# EasyEDA Pro project 3轴6.1--esp32 -(0604)改.eprj, board PCB
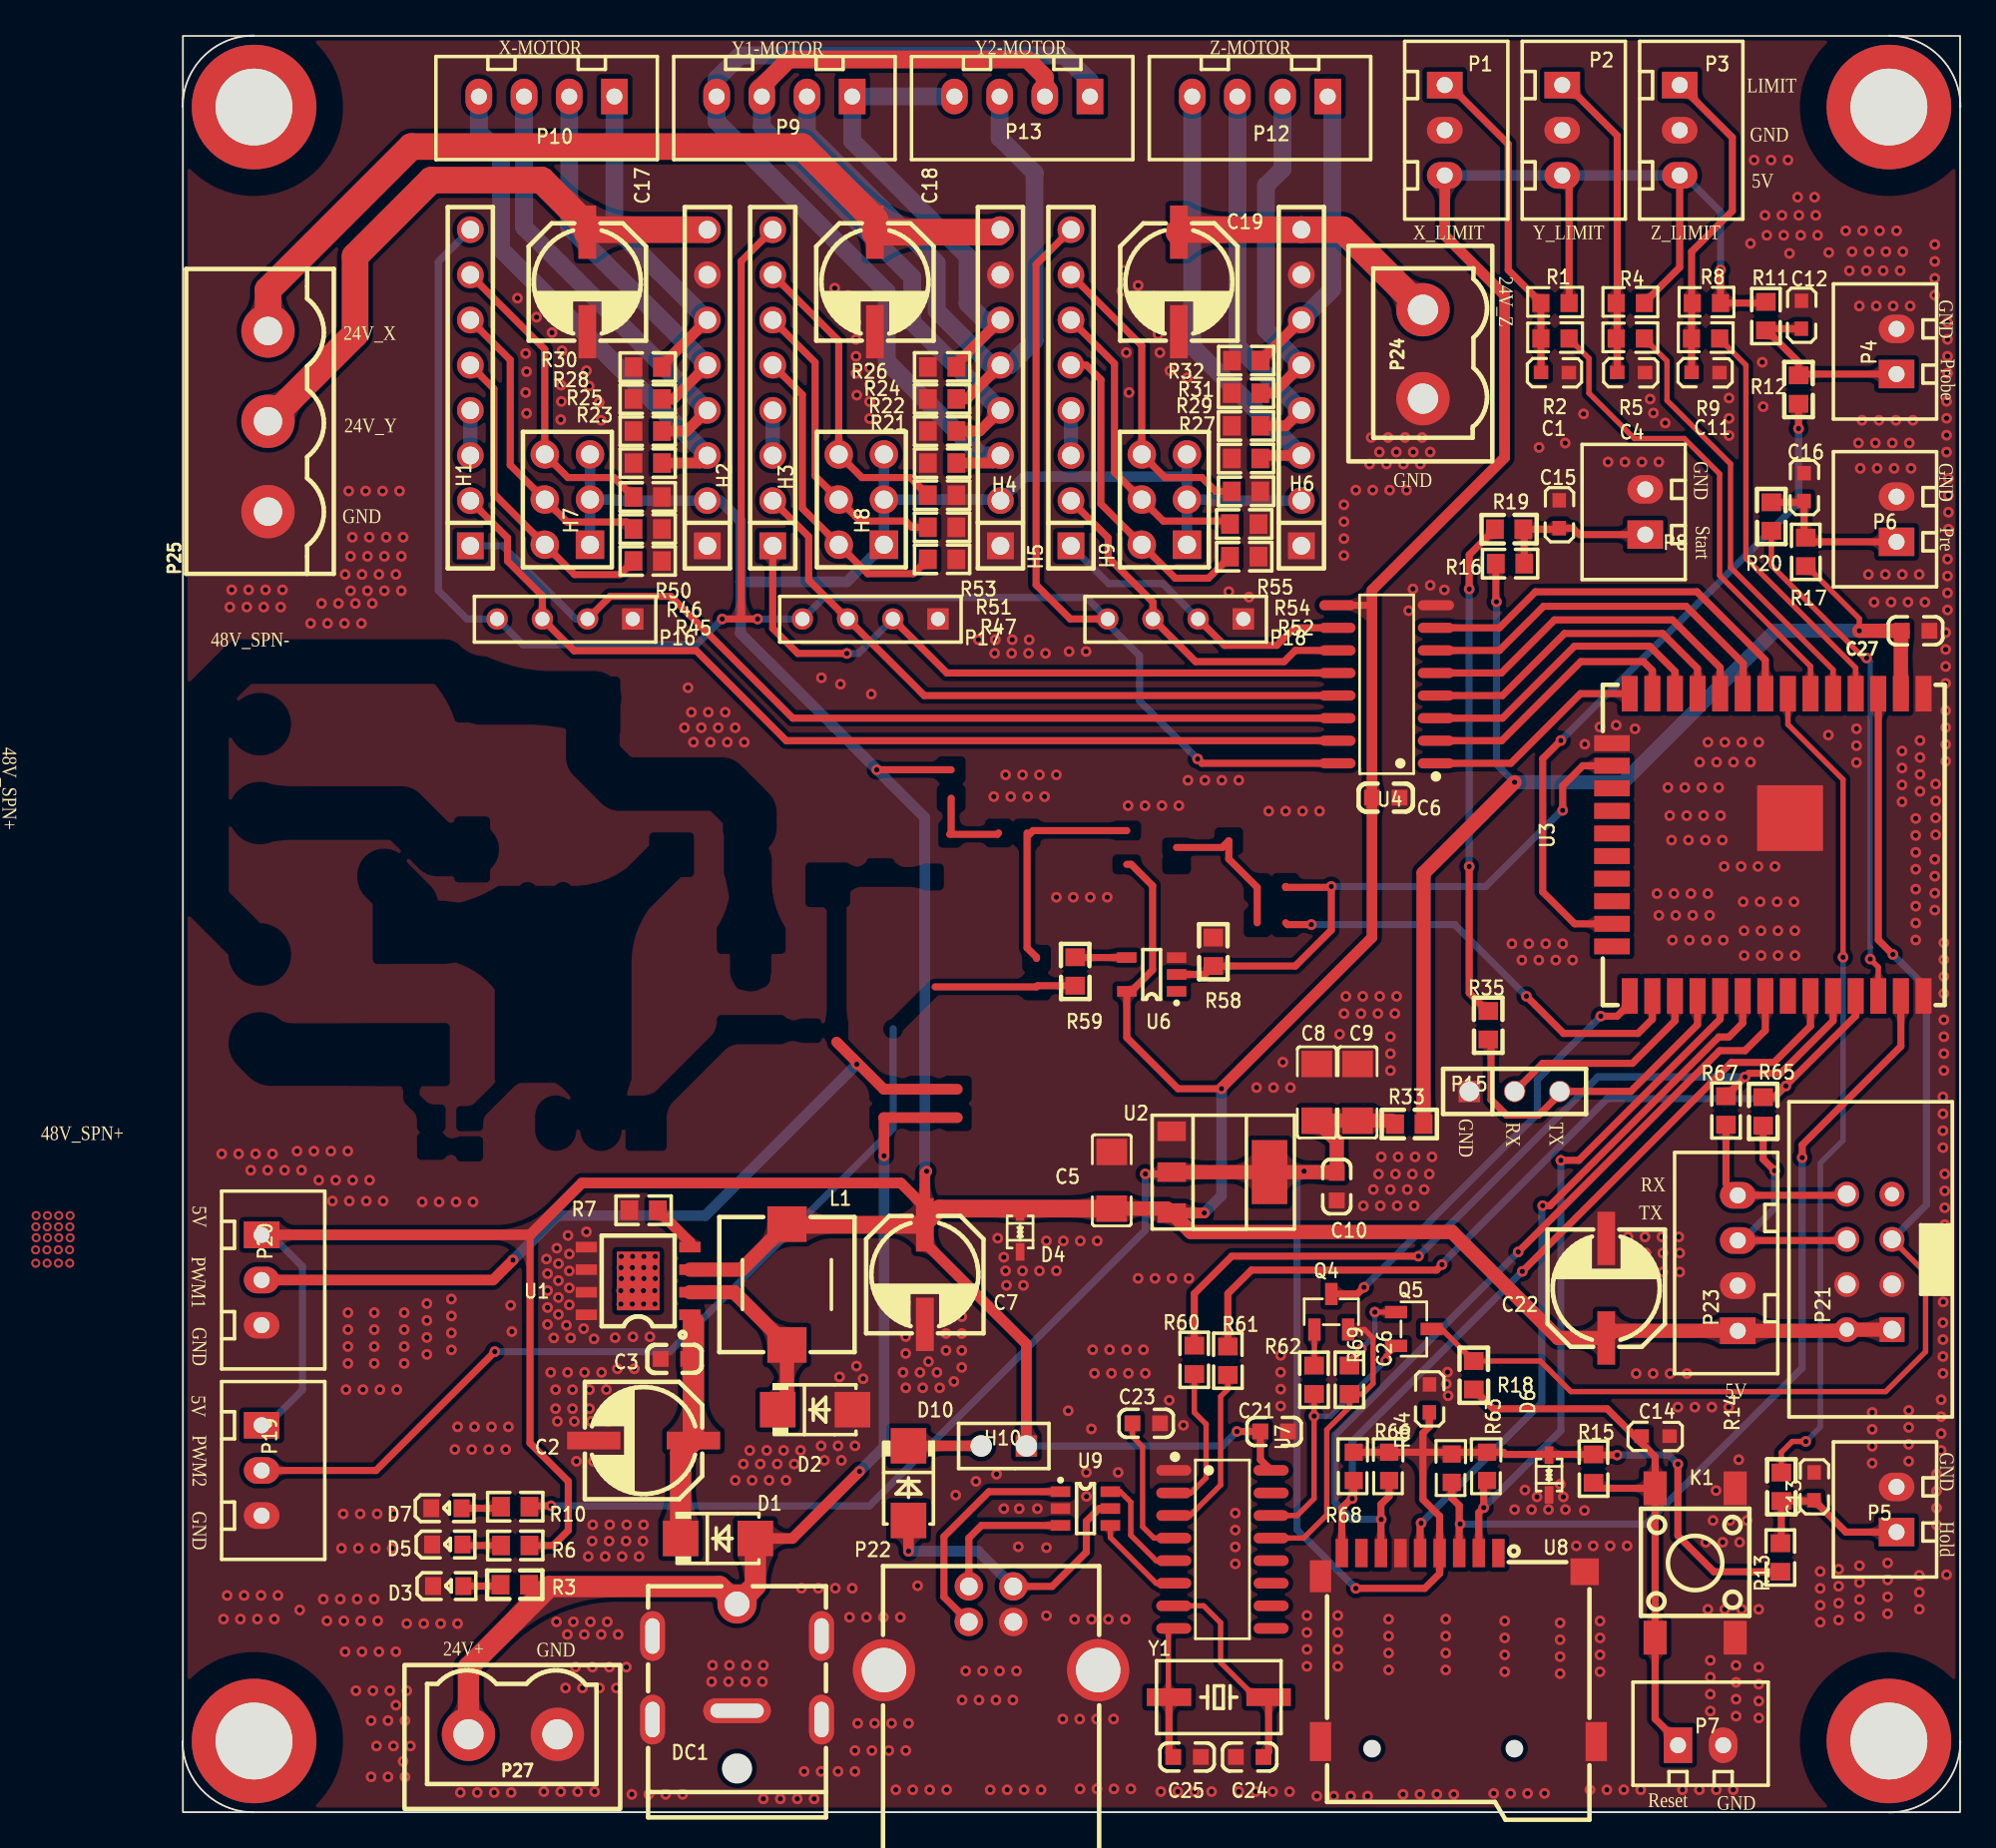
[diagram p1: board, top side]
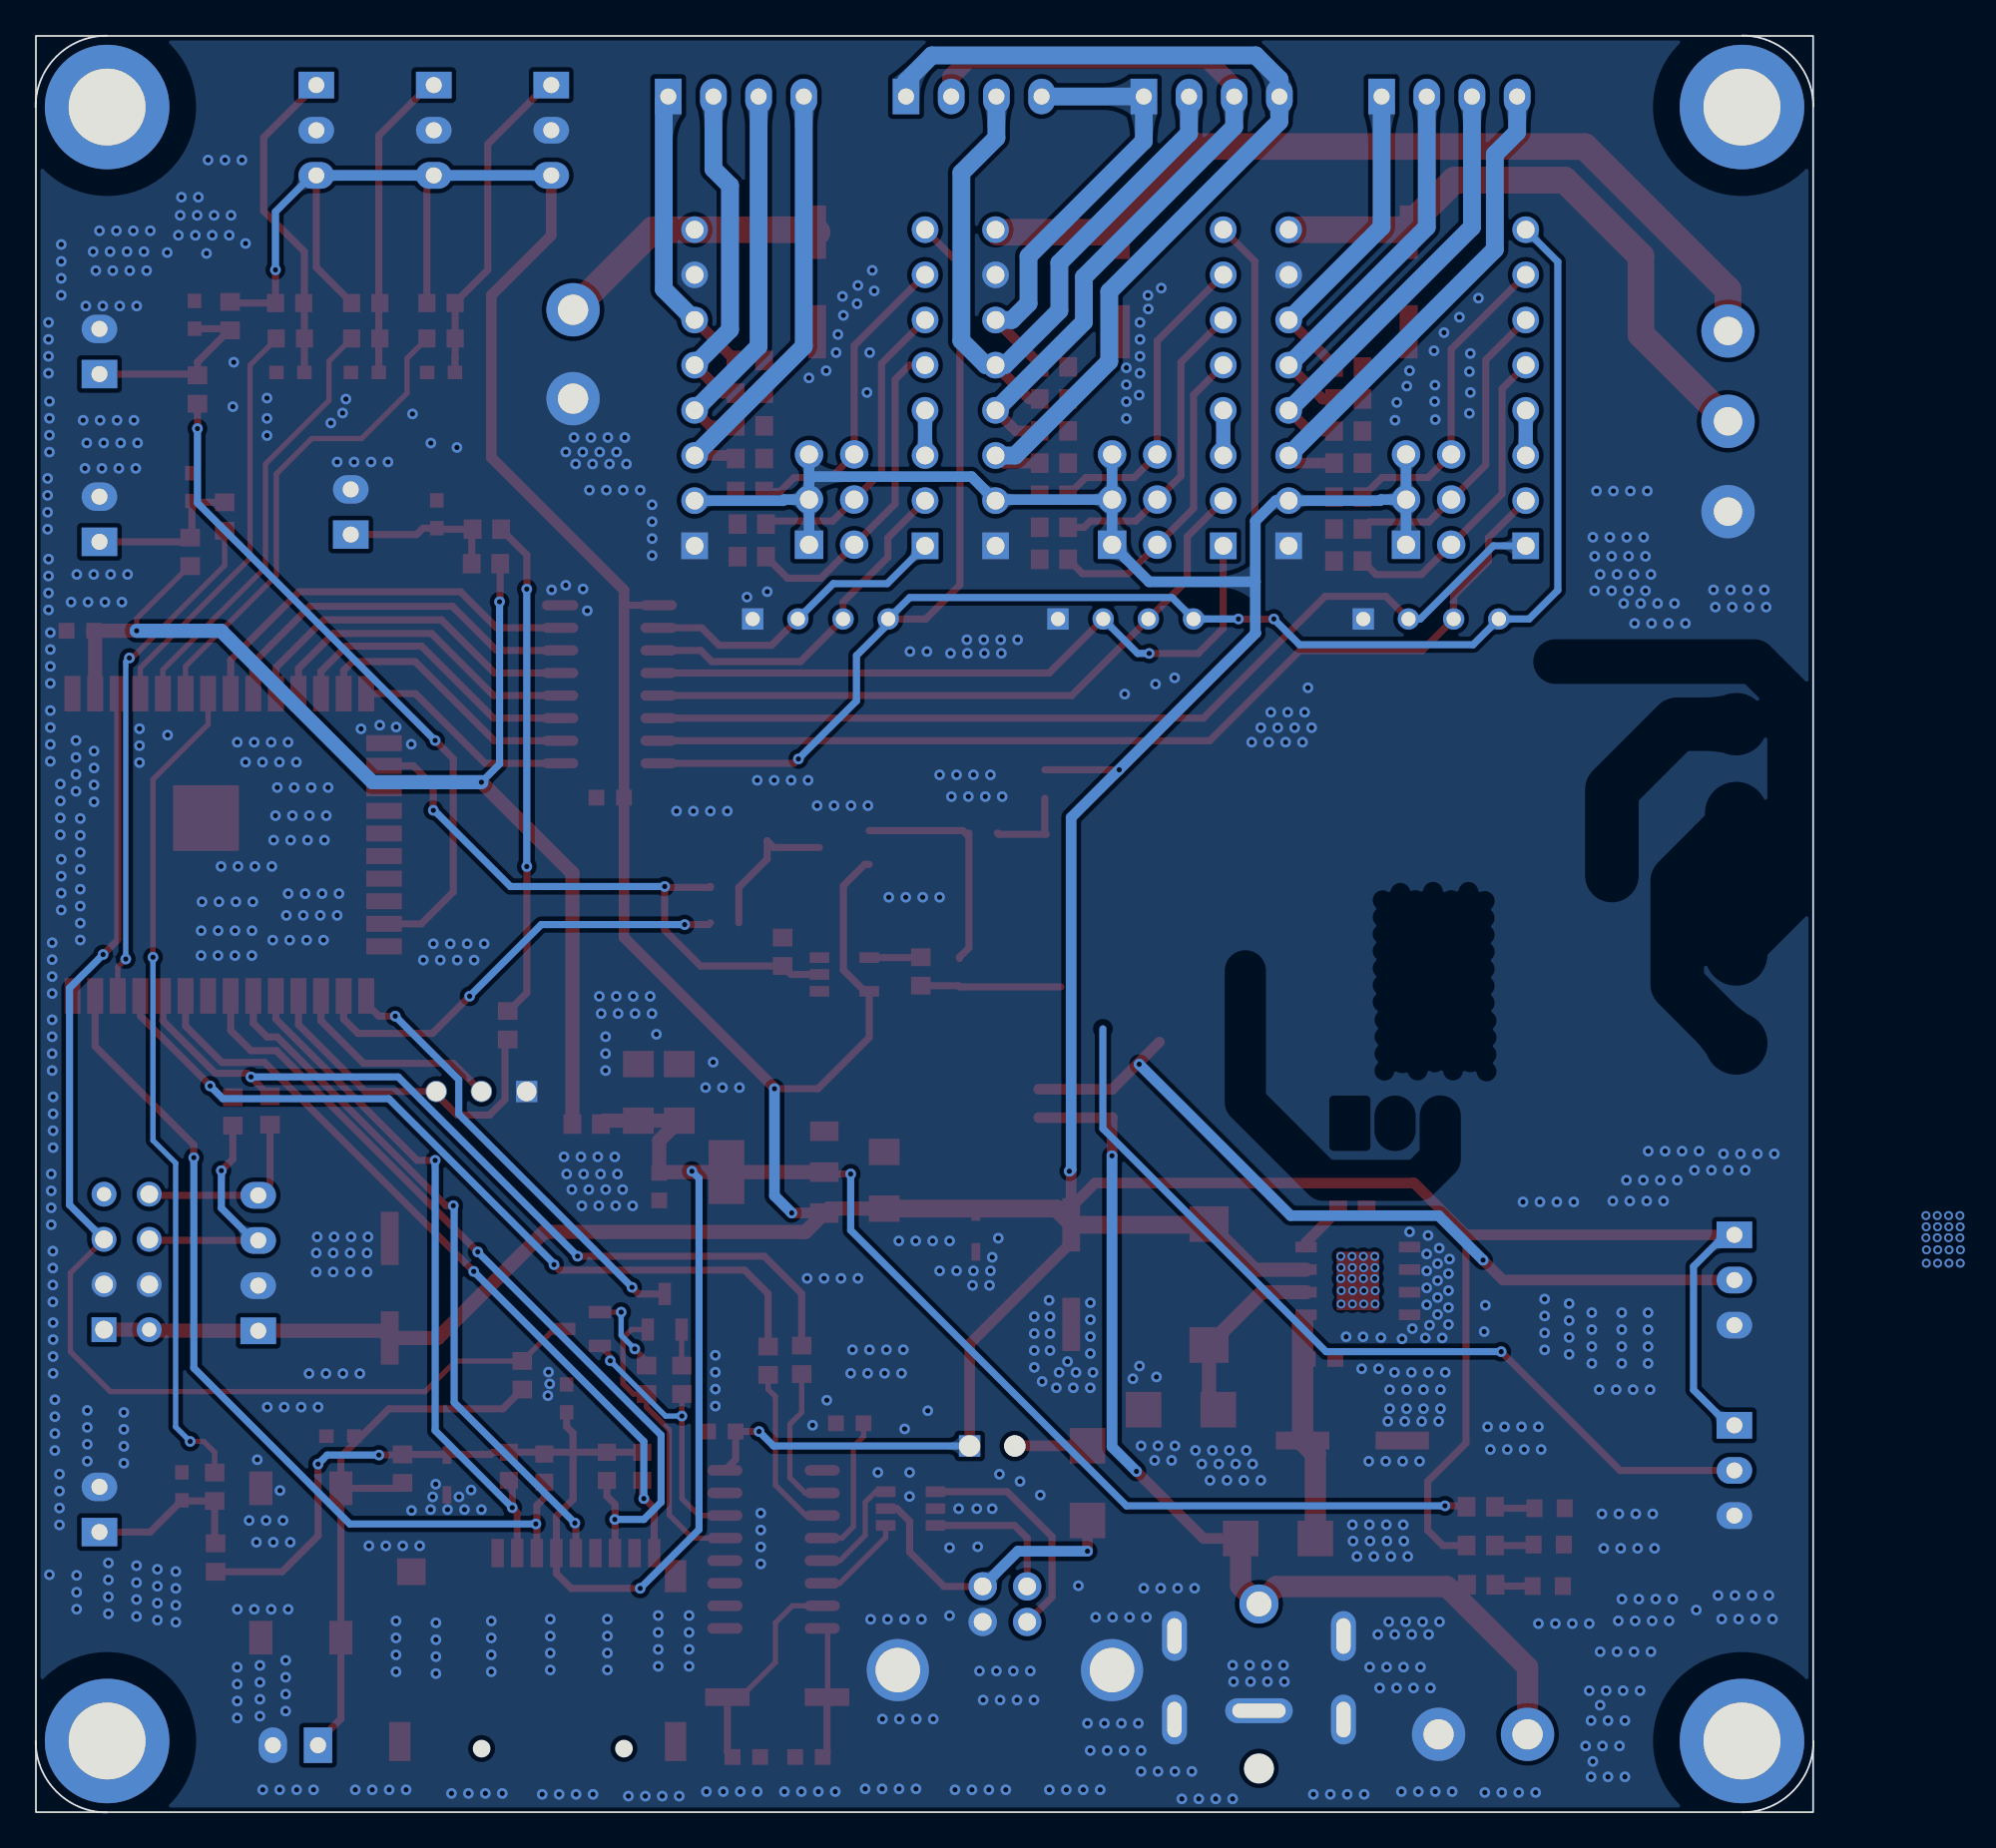
[diagram p2: board, bottom side, seen from below]

Outline 99.94 x 99.94 mm; copper layers: Top Layer, Bottom Layer. Coordinates in mm from the lower left corner of the outline.
Outline path: rectangle 0.02,99.92 99.92,0.02 ; 0.01,95.94 arc(1.18,98.77) 4.01,99.94 ; 4,0.01 arc(1.17,1.18) 0,4.01 ; 95.94,99.93 arc(98.77,98.76) 99.94,95.93 ; 99.93,4 arc(98.76,1.17) 95.93,0
Stack: Top Layer 0.035mm / Dielectric1 1.51mm FR4 er 4.5 / Bottom Layer 0.035mm

## Design rules (mm)
template: 用户自定义配置
spacing Default (default): track to track 0.152, other pairs 0 to 0.152
track width Default (default): min 0.254, default 0.254, max 25.4
differential pair differentialPair (default): width min 0.127, default 0.254, max 2.54; gap min 0.152, default 0.152
via Default (default): diameter min 0.25, default 0.61, max 100.025; hole min 0.2, default 0.305, max 59.995

## Placement (name value [footprint] x y rotation side)
C1  103  [11]  77.88 80.69 0 top
C2  100uF/35V  [电解电容贴片6X6]  25.91 20.92 180 top
C3  104  [0603C]  27.65 25.51 0 top
C4  103  [11]  82.17 80.69 0 top
C5  10uF  [C1206]  52.23 35.55 90 top
C6  104  [0603C]  67.63 57.08 180 top
C7  100uF/35V  [电解电容贴片6X6]  41.72 30.25 270 top
C8  4.7uF  [C1206]  63.76 40.5 270 top
C9  4.7uF  [C1206]  66.05 40.5 270 top
C10  104  [0603C]  64.88 35.2 90 top
C11  103  [11]  86.35 80.69 0 top
C12  103  [11]  91.3 84.97 90 top
C13  103  [11]  92.01 19.08 90 top
C14  103  [11]  83.55 20.87 0 top
C15  103  [11]  77.68 73.75 90 top
C16  103  [11]  91.45 75.28 90 top
C17  100uF/35V(47uF/50V)  [电解电容贴片6X6]  22.75 86.08 270 top
C18  100uF/35V(47uF/50V)  [电解电容贴片6X6]  38.92 86.08 270 top
C19  100uF/35V(47uF/50V)  [电解电容贴片6X6]  56.01 86.08 270 top
C21  104  [0603C]  61.36 21.43 0 top
C22  100uF/35V  [电解电容贴片6X6]  80.03 29.48 90 top
C23  104  [0603C]  54.17 21.89 0 top
C24  18pF  [0603C]  59.98 3.12 180 top
C25  18pF  [0603C]  56.46 3.12 0 top
C26  104  [11]  70.39 24.03 90 top
C27  104  [0603C]  97.42 66.46 0 top
D1  SS56  [SMA]  30.1 15.41 0 top
D2  SS34  [SMA]  35.55 22.65 0 top
D3  绿光  [0603LED]  14.9 12.71 180 top
D4  PESD5V0L1BA-N  [SOD-323_L1.8-W1.3-LS2.5-BI]  47.08 32.65 90 top
D5  绿光  [0603LED]  14.85 15.05 180 top
D6  PESD3V3L1BA-N  [SOD-323_L1.8-W1.3-LS2.5-BI]  76.81 18.98 90 top
D7  绿光  [0603LED]  14.8 17.09 180 top
D10  SS34  [SMA]  40.81 18.52 270 top
DC1  DC007B-2.5  [DC-IN-TH_HX-DC007B-2.5]  31.17 8.47 90 top
H1  PZ254V-11-08P  [HDR-TH_8P-P2.54-V-M]  16.17 80.13 90 top
H2  PZ254V-11-08P  [HDR-TH_8P-P2.54-V-M]  29.5 80.13 90 top
H3  PZ254V-11-08P  [HDR-TH_8P-P2.54-V-M]  33.17 80.13 90 top
H4  PZ254V-11-08P  [HDR-TH_8P-P2.54-V-M]  45.97 80.13 90 top
H5  PZ254V-11-08P  [HDR-TH_8P-P2.54-V-M]  49.94 80.13 90 top
H6  PZ254V-11-08P  [HDR-TH_8P-P2.54-V-M]  62.89 80.13 90 top
H7  PZ254V-12-06P  [HDR-TH_PZ254V-12-06P-A40]  21.63 73.84 90 top
H8  PZ254V-12-06P  [HDR-TH_PZ254V-12-06P-A40]  38.16 73.84 90 top
H9  PZ254V-12-06P  [HDR-TH_PZ254V-12-06P-A40]  55.19 73.84 90 top
H10  PZ254V-11-02P  [HDR-TH_2P-P2.54-V-M]  46.16 20.61 180 top
K1  SW_6X6_H=12.0MM  [KEY-SMD_4P-L6.0-W6.0-P4.50-LS9.0]  85.03 14.03 270 top
L1  68uH  [IND-SMD_L7.0-W7.0_SMDRI74-330MT]  33.97 29.69 270 top
NOREF  -  [Pad_ie50]  4.02 95.92 90 top
NOREF#2  -  [Pad_ie51]  4.02 4.02 90 top
NOREF#3  -  [Pad_ie52]  95.92 4.02 90 top
NOREF#4  -  [Pad_ie53]  95.92 95.92 90 top
P1  3P  [HDR1X3_CON]  70.95 94.61 270 top
P2  3P  [HDR1X3_CON]  77.55 94.61 270 top
P3  3P  [HDR1X3_CON]  84.16 94.61 270 top
P4  2P  [HDR1X2_CON]  96.35 82.17 90 top
P5  2P  [HDR1X2_CON]  96.35 17.04 90 top
P6  2P  [HDR1X2_CON]  96.35 72.73 90 top
P7  2P  [HDR1X2_CON]  85.33 3.78 0 top
P8  2P  [HDR1X2_CON]  82.22 73.14 90 top
P9  4P  [HDR1X4_CON]  37.64 96.51 180 top
P10  4P  [HDR1X4_CON]  24.27 96.51 180 top
P12  4P  [HDR1X4_CON]  64.37 96.51 180 top
P13  4P  [HDR1X4_CON]  51.01 96.51 180 top
P15  PZ254V-11-03P  [HDR-TH_3P-P2.54-V-M]  74.88 40.55 0 top
P16  4P  [SIP4]  25.3 67.12 180 top
P17  4P  [SIP4]  42.46 67.12 180 top
P18  4P  [SIP4]  59.63 67.12 180 top
P19  3P  [HDR1X3_CON]  4.44 19.23 270 top
P20  3P  [HDR1X3_CON]  4.44 29.94 270 top
P21  8P  [IDC8]  95.07 30.96 90 top
P22  USB-B10-BRW  [USB-B-TH_USB-B10-BRW]  45.45 10.36 0 top
P23  4P  [HDR1X4_CON]  87.42 27.09 90 top
P24  5.08-2P  [CONN-TH_WJ2EDGVC-5.08-2P]  69.72 82.02 90 top
P25  5.08-3P  [CONN-TH_3P-P5.08-WJ2EDGVC-3P]  4.8 78.24 90 top
P27  5.08-2P  [CONN-TH_WJ2EDGVC-5.08-2P]  18.57 4.39 180 top
Q4  SS8050  [SOT-23-3_L2.9-W1.3-P1.90-LS2.4-BR]  64.57 28.16 270 top
Q5  SS8050  [SOT-23-3_L2.9-W1.3-P1.90-LS2.4-BR]  69.21 27.19 180 top
R1  20K  [10]  76.25 84.78 0 top
R2  100  [10]  76.25 82.78 0 top
R3  47K  [0603R]  18.67 12.81 0 top
R4  20K  [10]  80.49 84.78 0 top
R5  100  [10]  80.49 82.78 0 top
R6  10K  [0603R]  18.7 15.01 0 top
R7  10K  [0603R]  25.91 33.87 180 top
R8  20K  [10]  84.76 84.78 0 top
R9  100  [10]  84.72 82.78 0 top
R10  10K  [0603R]  18.7 17.19 0 top
R11  10K  [0603R]  89 84.16 270 top
R12  100  [0603R]  90.84 80.03 90 top
R13  10K  [0603R]  89.82 14.34 90 top
R14  100  [0603R]  89.87 18.32 270 top
R15  10K  [0603R]  79.31 19.34 270 top
R16  10K  [0603R]  74.62 70.23 0 top
R17  10K  [0603R]  91.25 70.9 90 top
R18  100  [0603R]  72.58 24.59 270 top
R19  100  [0603R]  74.57 72.17 0 top
R20  100  [0603R]  89.31 72.89 90 top
R21  10K  [0603R]  42.69 75.89 180 top
R22  10K  [0603R]  42.69 77.7 180 top
R23  10K  [0603R]  26.15 75.89 180 top
R24  10K  [0603R]  42.69 79.5 180 top
R25  10K  [0603R]  26.15 77.69 180 top
R26  10K  [0603R]  42.69 81.3 180 top
R27  10K  [0603R]  59.78 76.15 180 top
R28  10K  [0603R]  26.15 79.49 180 top
R29  10K  [0603R]  59.78 77.99 180 top
R30  10K  [0603R]  26.15 81.29 180 top
R31  10K  [0603R]  59.78 79.82 180 top
R32  10K  [0603R]  59.79 81.65 180 top
R33  0Ω  [0603R]  68.96 38.72 0 top
R35  0Ω  [0603R]  73.4 44.27 90 top
R45  10K  [0603R]  26.15 70.39 0 top
R46  10K  [0603R]  26.15 72.19 0 top
R47  10K  [0603R]  42.69 70.48 0 top
R50  10K  [0603R]  26.15 73.99 0 top
R51  10K  [0603R]  42.69 72.28 0 top
R52  10K  [0603R]  59.68 70.63 0 top
R53  10K  [0603R]  42.69 74.08 0 top
R54  10K  [0603R]  59.68 72.46 0 top
R55  10K  [0603R]  59.78 74.3 0 top
R58  10K  [0603R]  57.94 48.41 90 top
R59  100  [0603R]  50.18 47.3 270 top
R60  510Ω  [0603R]  56.87 25.46 90 top
R61  510Ω  [0603R]  58.76 25.41 90 top
R62  10K  [0603R]  63.6 24.33 90 top
R63  10K  [10]  73.45 18.57 90 top
R64  10K  [10]  71.46 18.47 90 top
R65  510Ω  [0603R]  88.85 39.43 270 top
R66  10K  [10]  67.94 18.57 90 top
R67  510Ω  [0603R]  86.76 39.48 270 top
R68  10K  [10]  65.95 18.57 90 top
R69  10K  [0603R]  65.59 24.33 90 top
U1  XL1509-5.0E1//SXL1509-5.0E1  [ESOP-8_L4.9-W3.9-P1.27-LS6.0-BL-EP]  25.61 29.89 90 top
U2  1117-3.3  [SOT-223]  58.3 36.01 270 top
U3  ESP32-WROOM-32  [WIFI-SMD_ESP32-WROOM-32UE-A]  89.1 54.42 270 top
U4  ULN2003a  [SOP-16_L9.9-W3.9-P1.27-LS6.0-BL]  67.68 63.45 90 top
U6  74LVC1G17  [SOT-23-5]  54.48 47.13 180 top
U7  CH340G  [SOIC-16_L9.9-W3.9-P1.27-LS6.0-BL]  58.45 14.8 270 top
U8  自弹TF卡座TFAA  [SIM-SMD_C9900015645]  71.71 9.29 0 top
U9  USBLC2-2SC6  [SOT-23-6]  50.75 17.09 0 top
Y1  12M  [晶振贴片49SSMD]  58.25 6.48 0 top

## Footprints (pads in the part's own frame, mm; a bottom-side part is the same pattern mirrored in y, then rotated)
10
  rect 0.965x1.016 smd: 1(0.101,0.117) 2(1.688,0.117)
11
  rect 0.813x0.762 smd: 1(0.043,0.296) 2(-1.524,0.301)
0603C
  rect 0.889x0.889 smd: 1(-0.774,0) 2(0.774,0)
0603LED
  rect 0.9x1 smd: 1(-0.884,-0.017) 2(0.816,-0.017)
0603R
  rect 1x1.1 smd: 1(-0.8,0) 2(0.8,0)
C1206
  rect 1.485x1.728 smd: 1(-1.593,0) 2(1.593,0)
CONN-TH_3P-P5.08-WJ2EDGVC-3P
  round 3 hole 1.6: 1(-5.08,0) 2(0,0) 3(5.08,0)
CONN-TH_WJ2EDGVC-5.08-2P
  round 3 hole 1.7: 1(-2.499,0) 2(2.499,0)
DC-IN-TH_HX-DC007B-2.5
  round 2.2 hole 1.4: 1(3.25,0)
  oval 1.4x3.8 hole 0.8x3: 2(-2.75,0)
  oval 2.8x1.4 hole 2x0.8: 3(-3.25,4.75) 3(-3.25,-4.75) 3(1.45,4.75) 3(1.45,-4.75)
ESOP-8_L4.9-W3.9-P1.27-LS6.0-BL-EP
  rect 0.6x1.2 smd: 1(-1.905,-2.909) 2(-0.635,-2.909) 3(0.635,-2.909) 4(1.905,-2.909) 5(1.905,2.909) 6(0.635,2.909) 7(-0.635,2.909) 8(-1.905,2.909)
  rect 3.3x2.4 smd: 9(0,0)
HDR1X2_CON
  rect 1.6x2 hole 0.9: 1(-1.27,0)
  oval 1.6x2 hole 0.9: 2(1.27,0)
HDR1X3_CON
  rect 1.5x2 hole 0.9: 1(-2.54,0)
  oval 1.5x2 hole 0.9: 2(0,0) 3(2.54,0)
HDR1X4_CON
  rect 1.5x2 hole 0.9: 1(0,0)
  oval 1.5x2 hole 0.9: 2(2.54,0) 3(5.08,0) 4(7.62,0)
HDR-TH_2P-P2.54-V-M
  rect 1.2x1.2 hole 1.2x0.8: 1(-1.27,0)
  round 1.2 hole 1.2x0.8: 2(1.27,0)
HDR-TH_3P-P2.54-V-M
  rect 1.2x1.2 hole 1.1x0.8: 1(-2.54,0)
  round 1.2 hole 1.1x0.8: 2(0,0) 3(2.54,0)
HDR-TH_8P-P2.54-V-M
  rect 1.5x1.5 hole 1: 1(-8.89,0)
  round 1.5 hole 1: 2(-6.35,0) 3(-3.81,0) 4(-1.27,0) 5(1.27,0) 6(3.81,0) 7(6.35,0) 8(8.89,0)
HDR-TH_PZ254V-12-06P-A40
  rect 1.6x1.6 hole 1.02: 1(-2.54,-1.27)
  round 1.6 hole 1.02: 2(-2.54,1.27) 3(0,-1.27) 4(0,1.27) 5(2.54,-1.27) 6(2.54,1.27)
IDC8
  rect 1.4x1.4 hole 1: 1(-3.812,-1.019)
  round 1.4 hole 0.8: 2(-3.812,1.521) 7(3.808,-1.019)
  round 1.4 hole 1: 3(-1.272,-1.019) 4(-1.272,1.521) 5(1.268,-1.019) 6(1.268,1.521) 8(3.808,1.521)
IND-SMD_L7.0-W7.0_SMDRI74-330MT
  rect 2x2.2 smd: 1(-3.4,0) 2(3.4,0)
KEY-SMD_4P-L6.0-W6.0-P4.50-LS9.0
  rect 1.9x1.3 smd: 1(-4.2,2.25) 2(4.2,2.25) 3(-4.2,-2.25) 4(4.2,-2.25)
Pad_ie50
  round 7 hole 4.32: 0(0,0)
Pad_ie51
  round 7 hole 4.32: 0(0,0)
Pad_ie52
  round 7 hole 4.32: 0(0,0)
Pad_ie53
  round 7 hole 4.32: 0(0,0)
SIM-SMD_C9900015645
  rect 0.7x1.6 smd: 1(2.25,5.3) 2(1.15,5.3) 3(0.05,5.3) 4(-1.05,5.3) 5(-2.15,5.3) 6(-3.25,5.3) 7(-4.35,5.3) 8(-5.45,5.3) 9(-6.55,5.3)
  rect 1.2x1.8 smd: 10(-7.75,4)
  rect 1.6x1.5 smd: 11(7.1,4.25)
  rect 1.2x2.2 smd: 12(-7.75,-5.3) 13(7.75,-5.3)
SIP4
  rect 1.2x1.2 hole 0.8: 1(0,0)
  round 1.2 hole 0.8: 2(2.54,0) 3(5.08,0) 4(7.62,0)
SMA
  rect 2x2 smd: 1(2.1,0) 2(-2.1,0)
SOD-323_L1.8-W1.3-LS2.5-BI
  rect 0.986x0.49 smd: 1(-1.117,0) 2(1.117,0)
SOIC-16_L9.9-W3.9-P1.27-LS6.0-BL
  oval 0.602x1.971 smd: 1(-4.445,-2.736) 2(-3.175,-2.736) 3(-1.905,-2.736) 4(-0.635,-2.736) 5(0.635,-2.736) 6(1.905,-2.736) 7(3.175,-2.736) 8(4.445,-2.736) 9(4.445,2.736) 10(3.175,2.736) 11(1.905,2.736) 12(0.635,2.736) 13(-0.635,2.736) 14(-1.905,2.736) 15(-3.175,2.736) 16(-4.445,2.736)
SOP-16_L9.9-W3.9-P1.27-LS6.0-BL
  oval 0.574x2.038 smd: 1(-4.445,-2.769) 2(-3.175,-2.769) 3(-1.905,-2.769) 4(-0.635,-2.769) 5(0.635,-2.769) 6(1.905,-2.769) 7(3.175,-2.769) 8(4.445,-2.769) 9(4.445,2.769) 10(3.175,2.769) 11(1.905,2.769) 12(0.635,2.769) 13(-0.635,2.769) 14(-1.905,2.769) 15(-3.175,2.769) 16(-4.445,2.769)
SOT-23-3_L2.9-W1.3-P1.90-LS2.4-BR
  rect 1.25x0.7 smd: 1(1,-0.95) 2(1,0.95) 3(-1,0)
SOT-23-5
  rect 1.1x0.6 smd: 1(-1.4,0.95) 2(-1.4,0) 3(-1.4,-0.95) 4(1.4,-0.95) 5(1.4,0.95)
SOT-23-6
  rect 1.1x0.6 smd: 1(-1.4,0.95) 2(-1.4,0) 3(-1.4,-0.95) 4(1.4,-0.95) 5(1.4,0) 6(1.4,0.95)
SOT-223
  rect 1.1x1.6 smd: 1(-2.3,-2.7) 2(0,-2.7) 3(2.3,-2.7)
  rect 3.6x2 smd: 4(0,2.8)
USB-B-TH_USB-B10-BRW
  round 1.6 hole 1: 1(1.25,2.355) 2(-1.25,2.355) 3(-1.25,0.355) 4(1.25,0.355)
  round 3.5 hole 2.5: 5(-6.02,-2.355) 6(6.02,-2.355)
WIFI-SMD_ESP32-WROOM-32UE-A
  rect 2x0.9 smd: 1(-8.5,8.755) 2(-8.5,7.485) 3(-8.5,6.215) 4(-8.5,4.945) 5(-8.5,3.675) 6(-8.5,2.405) 7(-8.5,1.135) 8(-8.5,-0.135) 9(-8.5,-1.405) 10(-8.5,-2.675) 11(-8.5,-3.945) 12(-8.5,-5.215) 13(-8.5,-6.485) 14(-8.5,-7.755) 25(8.5,-7.755) 26(8.5,-6.485) 27(8.5,-5.215) 28(8.5,-3.945) 29(8.5,-2.675) 30(8.5,-1.405) 31(8.5,-0.135) 32(8.5,1.135) 33(8.5,2.405) 34(8.5,3.675) 35(8.5,4.945) 36(8.5,6.215) 37(8.5,7.485) 38(8.5,8.755)
  rect 0.9x2 smd: 15(-5.715,-8.755) 16(-4.445,-8.755) 17(-3.175,-8.755) 18(-1.905,-8.755) 19(-0.635,-8.755) 20(0.635,-8.755) 21(1.905,-8.755) 22(3.175,-8.755) 23(4.445,-8.755) 24(5.715,-8.755)
  rect 3.7x3.7 smd: 39(-1.5,1.255)
晶振贴片49SSMD
  rect 2.5x1 smd: 1(-2.8,0) 2(2.8,0)
电解电容贴片6X6
  rect 3x1 smd: 1(-2.8,0) 2(2.8,0)

## Nets
As in the schematic.

Pads without a net: NOREF 0; NOREF#2 0; NOREF#3 0; NOREF#4 0; P21 7; U1 9; U3 17 18 19 20 21 22 32; U6 1; U7 9 10 11 12 15; U8 1 8

## Via types
v1: diameter 0.5, hole 0.3, Top Layer to Bottom Layer, 40 vias
v2: diameter 0.6, hole 0.3, Top Layer to Bottom Layer, 941 vias

## Routing (per net, layer and track width the routed paths; a pad name or vN(x,y) marks a point on that pad's centre or on a via; arc(x,y) is an arc through that point)
3V3: length 131.7
  Top Layer w0.4: 69.72,20.26 69.72,21.34 70.09,21.7 C26.2 ; 69.72,20.26 69.72,17.6 70.66,16.66 U8.4 70.66,13.44 69.83,12.6 v2(65.95,12.6) ; 69.72,20.26 R66.2 R68.2 ; 69.72,20.26 R63.2 74.24,20.26 74.36,20.14 79.31,20.14 79.35,20.1 v2(80.64,20.1) ; v2(84.06,19.59) 84.06,15.56 86.08,13.54 R13.1 ; v2(54.12,35.91) 55.5,35.91 U2.2 ; R10.2 19.55,17.24 v2(20.71,17.24)
  Top Layer w0.8: R33.1 67.97,38.91 C9.2 C8.2 64.88,37.79 C10.2 ; 64.84,36.01 U2.4 U2.2
  Bottom Layer w0.4: v2(65.95,12.6) 62.64,15.91 62.64,35.66 v2(63.04,36.06) ; v2(54.12,35.91) 54.12,32.75 38.61,17.24 v2(20.71,17.24) ; v2(84.06,19.59) 83.55,20.1 v2(80.64,20.1)
3V_MCU: length 67.8
  Top Layer w0.3: R17.1 91.3,70.1 94.26,67.14 v2(94.26,66.46)
  Top Layer w0.4: R16.1 73.82,68.13 v2(73.86,68.09)
  Top Layer w0.8: U3.2 96.59,66.3 96.69,66.41 ; v2(74.88,57.94) 69.76,52.83 R33.2 ; v2(94.26,66.46) C27.1
  Bottom Layer w0.4: v2(73.86,68.09) 73.86,58.96 v2(74.88,57.94)
  Bottom Layer w0.8: v2(94.26,66.46) 89.51,66.46 81,57.94 v2(74.88,57.94)
5V_VCC: length 407
  Top Layer w0.4: 19.53,32.48 19.53,20.77 21.68,18.62 21.68,15.87 20.83,15.01 R6.2 ; R1.2 77.94,91.68 P2.3 ; U7.16 60.59,19.84 C21.1 v2(59.27,21.43) ; v2(58.4,40.7) 55.95,40.7 53.08,43.58 U6.5 53.33,46.18 54.53,47.38 54.53,52.12 53.33,53.32 53.08,53.32 ; R4.2 82.17,84.92 84.16,86.9 P3.3 ; R11.1 88.94,84.89 R8.2 86.45,86.76 ; U4.9 66.81,67.9 66.86,67.84 ; 43.2,58.64 v2(39.02,58.64)
  Top Layer w0.6: P20.1 19.53,32.48 22.45,35.4 40.37,35.4 41.72,34.05 41.72,35.96 v2(41.83,36.06) ; v2(58.4,40.7) 58.4,40.76 66.86,49.21 C6.2 66.86,68.75 74.31,76.2 74.31,85.33 70.95,88.7 P1.3 ; v2(57.43,33.72) 55.61,33.72 U2.3 ; H10.1 47.43,26.34 41.72,32.05 C7.1
  Top Layer w0.8: P21.1 P21.2 93.49,27.09 P23.1 80.43,27.09 C22.1 77.32,26.69 71.36,32.65 56.67,32.65 U2.3 55.35,33.96 C5.1 ; U1.3 31.41,30.53 L1.1
  Top Layer w1: C5.1 42.54,33.96 41.72,33.15 C7.1 34.01,33.05 L1.1
  Bottom Layer w0.4: P3.3 84.41,92.07 86.45,90.03 v2(86.45,86.76) ; 4.5,21.77 4.75,21.77 6.74,23.77 6.74,30.71 4.96,32.48 P20.1 ; v2(59.27,21.43) 58.45,20.61 H10.1
  Bottom Layer w0.6: H7.1 22.9,73.84 ; v2(58.4,40.7) 58.4,34.69 v2(57.43,33.72) ; 31.37,69.21 31.37,66.35 31.35,66.33 41.72,55.95 41.72,36.17 v2(41.83,36.06) ; 31.37,69.21 37.34,69.21 39.43,71.3 ; 31.37,69.21 31.37,72.63 30.22,73.78 H2.2 24.36,73.78 24.3,73.84 H7.3 H7.5 ; H8.3 39.43,71.3 ; H8.3 45.91,73.84 H4.2 47.33,75.13 56.21,75.13 56.26,75.08 ; H8.3 H8.5 ; H9.3 56.46,71.3 ; H9.3 H9.5 ; H9.3 57.86,73.84 57.92,73.78 H6.2 ; P3.3 P2.3 P1.3
24V: length 58.5
  Top Layer w0.4: 20.61,12.71 20.51,12.81 R3.2
  Top Layer w0.6: D1.1 34.28,15.41 v2(38.05,19.18) ; 43.55,39.08 39.42,39.08 39.43,39.06 v2(39.43,36.93)
  Top Layer w1.2: P27.2 16.07,8.17 20.61,12.71 30.19,12.71 DC1.1 32.2,12.75 D1.1
  Bottom Layer w0.6: v2(39.43,36.93) 39.43,20.56 v2(38.05,19.18)
24V_X: length 34.4
  Top Layer w1.5: H2.8 22.89,89.02 C17.1 22.75,89.24 20.18,91.81 13.98,91.81 9.7,87.52 9.7,83.14 P25.2
24V_Y: length 49.3
  Top Layer w1.5: P25.3 4.8,85.64 12.86,93.69 34.81,93.69 38.92,89.58 C18.1 45.84,88.88 H4.8
24V_Z: length 15.6
  Top Layer w1.5: C19.1 56.14,89.02 H6.8 65.22,89.02 P24.2
GND:
  vias: v2(2.2,37.04) v2(2.3,10.88) v2(2.5,12.2) v2(2.66,67.79) v2(2.76,68.76) v2(3.15,37.04) v2(3.25,10.88) v2(3.46,12.2) v2(3.61,67.79) v2(3.71,68.76) v2(3.83,36.12) v2(4.1,37.04) v2(4.2,10.88) v2(4.41,12.2) v2(4.56,67.79) v2(4.66,68.76) v2(4.78,36.12) v2(5.06,37.04) v2(5.16,10.88) v2(5.36,12.2) v2(5.51,67.79) v2(5.62,68.76) v2(5.73,36.12) v2(6.43,37.19) v2(6.58,11.39) v2(6.69,36.12) v2(7.2,66.88) v2(7.38,37.19) v2(7.66,35.56) v2(7.81,68) v2(7.91,12) v2(8.11,10.77) v2(8.15,66.88) v2(8.34,37.19) v2(8.42,34.39) v2(8.61,35.56) v2(8.76,68) v2(8.93,14.85) v2(8.86,12) v2(9.03,16.79) v2(9.14,69.63) v2(9.1,66.88) v2(9.07,10.77) v2(9.14,9.04) v2(9.19,23.78) v2(9.29,37.19) v2(9.3,28.11) v2(9.3,27.16) v2(9.3,26.2) v2(9.3,25.25) v2(9.34,74.32) v2(9.37,34.39) v2(9.44,70.65) v2(9.44,68.71) v2(9.54,71.72) v2(9.56,35.56) v2(9.71,68) v2(9.81,12) v2(9.75,6.85) v2(9.88,14.85) v2(9.98,16.79) v2(10.02,10.77) v2(10.09,69.63) v2(10.05,66.88) v2(10.09,9.04) v2(10.14,23.78) v2(10.29,74.32) v2(10.33,34.39) v2(10.39,70.65) v2(10.39,68.71) v2(10.5,71.72) v2(10.51,35.56) v2(10.6,5.16) v2(10.6,2) v2(10.67,68) v2(10.7,6.85) v2(10.78,28.11) v2(10.78,27.16) v2(10.78,26.2) v2(10.78,25.25) v2(10.83,14.85) v2(10.77,12) v2(10.94,16.79) v2(10.9,3.74) v2(10.97,10.77) v2(11.04,69.63) v2(11.09,23.78) v2(11.04,9.04) v2(11.24,74.32) v2(11.28,34.39) v2(11.34,70.65) v2(11.34,68.71) v2(11.45,71.72) v2(11.55,5.16) v2(11.55,2) v2(11.65,6.85) v2(11.79,14.85) v2(11.89,16.79) v2(11.86,3.74) v2(11.99,69.63) v2(11.99,9.04) v2(11.99,6.03) v2(12.04,23.78) v2(12.19,74.32) v2(12.3,70.65) v2(12.3,68.71) v2(12.4,71.72) v2(12.4,2.87) v2(12.46,28.11) v2(12.46,27.16) v2(12.46,26.2) v2(12.46,25.25) v2(12.5,5.16) v2(12.5,2) v2(12.6,10.62) v2(12.6,6.85) v2(12.81,3.74) v2(13.47,34.34) v2(13.56,10.62) v2(13.73,28.62) v2(13.73,27.67) v2(13.73,26.72) v2(13.73,25.76) v2(14.42,34.34) v2(14.51,10.62) v2(15.11,28.87) v2(15.11,27.92) v2(15.11,26.97) v2(15.11,26.02) v2(15.31,20.41) v2(15.37,34.34) v2(15.46,21.69) v2(15.46,10.62) v2(15.61,1.12) v2(16.33,34.34) v2(16.26,20.41) v2(16.41,21.69) v2(16.57,1.12) v2(17.21,20.41) v2(17.36,21.69) v2(17.52,1.12) v2(18.16,20.41) v2(18.31,21.69) v2(18.44,28.52) v2(18.51,27.04) v2(18.47,1.12) v2(18.83,85.17) v2(19.29,82.06) v2(19.29,79.86) v2(19.34,81.04) v2(19.34,78.69) v2(19.9,84.1) v2(20.31,1.17) v2(20.46,31.12) v2(20.52,30.3) v2(20.52,29.35) v2(20.52,28.4) v2(20.52,27.45) v2(20.69,24.75) v2(20.77,83.23) v2(20.86,26.69) v2(21.03,31.74) v2(20.97,23.78) v2(20.97,22.71) v2(21.02,10.72) v2(21.13,30.86) v2(21.13,29.91) v2(21.13,28.96) v2(21.13,28.01) v2(21.07,21.99) v2(21.33,82.21) v2(21.28,80.27) v2(21.29,79.36) v2(21.26,78.34) v2(21.26,1.17) v2(21.53,7) v2(21.58,27.4) v2(21.63,10.01) v2(21.66,32.45) v2(21.65,24.75) v2(21.74,31.41) v2(21.74,30.45) v2(21.74,29.5) v2(21.74,28.55) v2(21.82,26.69) v2(21.92,23.78) v2(21.92,22.71) v2(22.02,21.99) v2(21.97,10.72) v2(22.09,8.17) v2(22.14,19.75) v2(22.21,1.17) v2(22.48,7) v2(22.55,27.21) v2(22.6,24.75) v2(22.58,10.01) v2(22.7,81.09) v2(22.7,32.65) v2(22.8,14.4) v2(22.86,80.22) v2(22.87,23.78) v2(22.87,22.71) v2(22.92,10.72) v2(22.97,21.99) v2(23.02,15.26) v2(23.13,26.64) v2(23.09,19.75) v2(23.06,16.18) v2(23.04,8.17) v2(23.16,1.17) v2(23.42,79.3) v2(23.43,7) v2(23.52,78.3) v2(23.53,10.01) v2(23.55,24.75) v2(23.82,23.78) v2(23.82,22.71) v2(23.75,14.4) v2(23.92,21.99) v2(23.87,10.72) v2(24.01,16.18) v2(23.98,15.26) v2(23.99,8.17) v2(24.04,19.75) v2(24.31,26.7) v2(24.38,7) v2(24.44,24.95) v2(24.49,10.01) v2(24.71,14.4) v2(24.93,15.26) v2(25,19.75) v2(24.96,16.18) v2(24.94,8.17) v2(25.32,26.75) v2(25.25,1.02) v2(25.39,24.95) v2(25.66,14.4) v2(25.91,16.18) v2(25.88,15.26) v2(26.21,1.02) v2(26.27,26.75) v2(27.16,1.02) v2(28.11,1.02) v2(28.21,61.01) v2(28.41,63.25) v2(28.6,61.88) v2(28.72,60.19) v2(29.16,61.01) v2(29.55,61.88) v2(29.67,60.19) v2(29.79,8.28) v2(29.74,7.36) v2(30.11,61.01) v2(30.5,61.88) v2(30.62,60.19) v2(30.69,7.36) v2(30.74,8.28) v2(31.06,61.01) v2(31.06,18.68) v2(31.52,19.6) v2(31.57,60.19) v2(31.69,8.28) v2(31.64,7.36) v2(31.88,20.36) v2(32.02,18.68) v2(32.48,19.6) v2(32.59,7.36) v2(32.65,8.28) v2(32.65,0.76) v2(32.83,20.36) v2(32.97,18.68) v2(33.43,19.6) v2(33.6,0.76) v2(33.78,20.36) v2(33.92,18.68) v2(34.38,19.6) v2(34.55,0.76) v2(34.74,20.36) v2(34.79,12.61) v2(34.94,2.31) v2(35.5,0.76) v2(35.74,12.61) v2(35.91,63.82) v2(35.89,20.62) v2(35.89,2.31) v2(36.08,19.8) v2(36.66,85.73) v2(36.69,12.61) v2(36.93,24.49) v2(36.84,20.62) v2(36.84,2.31) v2(36.98,63.46) v2(37.03,19.8) v2(37.41,85.32) v2(37.39,84.56) v2(37.49,10.98) v2(37.64,12.61) v2(37.8,20.62) v2(37.8,3.48) v2(37.8,2.31) v2(37.86,83.8) v2(37.86,82.85) v2(37.86,81.9) v2(37.86,80.95) v2(37.9,79.71) v2(37.88,25.11) v2(37.95,5.01) v2(38.26,24.39) v2(38.44,10.98) v2(38.62,81.25) v2(38.62,80.3) v2(38.62,79.35) v2(38.62,78.4) v2(38.72,62.9) v2(38.75,3.48) v2(38.9,5.01) v2(39.4,10.98) v2(39.7,3.48) v2(39.85,5.01) v2(40.09,1.27) v2(40.35,10.98) v2(40.5,24.75) v2(40.65,28.67) v2(40.65,27.72) v2(40.65,26.76) v2(40.65,25.81) v2(40.65,23.88) v2(40.65,3.48) v2(40.81,5.01) v2(41.05,1.27) v2(41.32,12.75) v2(41.45,24.75) v2(41.61,23.88) v2(41.93,25.36) v2(42,1.27) v2(42.4,24.75) v2(42.56,23.88) v2(42.91,27.89) v2(42.91,26.93) v2(42.91,25.98) v2(42.97,28.8) v2(42.95,1.27) v2(43.36,24.24) v2(43.46,17.85) v2(43.8,27.89) v2(43.8,26.93) v2(43.8,25.98) v2(43.8,25.03) v2(43.82,6.32) v2(44.02,7.96) v2(44.6,18.62) v2(44.73,65.96) v2(44.77,6.32) v2(44.97,7.96) v2(45.4,1.27) v2(45.6,57.13) v2(45.69,65.96) v2(45.65,65.19) v2(45.72,6.32) v2(45.82,32.3) v2(45.76,19.02) v2(45.93,7.96) v2(46.16,31.23) v2(46.16,17.08) v2(46.26,58.36) v2(46.26,30.46) v2(46.31,29.64) v2(46.35,1.27) v2(46.64,65.96) v2(46.6,65.19) v2(46.55,57.13) v2(46.67,6.32) v2(46.88,7.96) v2(47.03,17.08) v2(46.98,14.94) v2(47.22,58.36) v2(47.22,30.46) v2(47.27,29.64) v2(47.3,1.27) v2(47.5,57.13) v2(47.59,65.96) v2(47.56,65.19) v2(48.05,17.08) v2(48.17,58.36) v2(48.17,30.46) v2(48.25,1.27) v2(48.51,65.19) v2(48.46,57.13) v2(48.56,32.14) v2(48.56,14.89) v2(48.56,11.07) v2(49.12,58.36) v2(49.12,51.47) v2(49.12,30.46) v2(49.51,32.14) v2(49.48,5.25) v2(49.83,65.29) v2(49.78,22.59) v2(50.07,51.47) v2(50.14,10.86) v2(50.43,5.25) v2(50.46,32.14) v2(50.45,1.33) v2(50.79,65.29) v2(50.8,19.12) v2(50.81,17.77) v2(51.02,51.47) v2(51.09,21.57) v2(51.09,10.86) v2(51.16,26.02) v2(51.26,24.7) v2(51.41,32.14) v2(51.38,5.25) v2(51.4,1.33) v2(51.98,51.47) v2(52.11,26.02) v2(52.05,10.86) v2(52.21,24.7) v2(52.33,5.25) v2(52.35,1.33) v2(52.59,19.12) v2(52.79,85.58) v2(52.9,86.73) v2(53,10.86) v2(53.05,82.11) v2(53.06,26.02) v2(53.2,79.86) v2(53.15,56.62) v2(53.17,24.7) v2(53.3,1.33) v2(53.71,85.88) v2(53.71,30.04) v2(53.76,84.85) v2(54.02,26.02) v2(54.1,56.62) v2(54.12,24.7) v2(54.53,84.2) v2(54.58,85.27) v2(54.66,30.04) v2(54.83,83.13) v2(54.94,82.11) v2(54.99,1.17) v2(55.05,56.62) v2(55.5,81.09) v2(55.46,23.19) v2(55.62,30.04) v2(56,56.62) v2(55.94,1.17) v2(56.26,21.78) v2(56.47,80.68) v2(56.51,58.05) v2(56.57,30.04) v2(56.89,1.17) v2(57.47,58.05) v2(57.84,1.17) v2(58.42,58.05) v2(58.81,68.66) v2(59.17,16.84) v2(59.17,15.89) v2(59.17,14.93) v2(59.17,13.98) v2(59.37,58.05) v2(59.37,1.17) v2(59.95,68.35) v2(60.32,1.17) v2(60.37,40.77) v2(61.05,56.32) v2(61.32,40.77) v2(61.28,1.17) v2(61.72,25.71) v2(61.72,24.76) v2(61.72,23.81) v2(61.72,22.86) v2(61.85,42.2) v2(62.01,56.32) v2(62.23,1.17) v2(62.28,40.77) v2(62.96,56.32) v2(63.2,11.07) v2(63.2,10.12) v2(63.2,9.17) v2(63.2,8.22) v2(63.76,0.92) v2(63.91,56.32) v2(64.71,0.92) v2(64.94,11.07) v2(64.94,10.12) v2(64.94,9.17) v2(64.94,8.22) v2(65.04,43.77) v2(65.28,73.55) v2(65.28,72.6) v2(65.28,71.64) v2(65.28,70.69) v2(65.29,44.93) v2(65.39,45.9) v2(65.66,0.92) v2(65.95,74.37) v2(66.24,44.93) v2(66.34,45.9) v2(66.37,34.12) v2(66.61,0.92) v2(66.72,75.84) v2(66.82,77.33) v2(66.9,74.37) v2(66.94,35.03) v2(67.19,44.93) v2(67.23,35.9) v2(67.28,76.51) v2(67.29,45.9) v2(67.33,34.12) v2(67.38,36.87) v2(67.68,75.84) v2(67.77,77.33) v2(67.79,10.87) v2(67.79,9.92) v2(67.79,8.97) v2(67.79,8.01) v2(67.85,74.37) v2(67.9,43.63) v2(67.9,42.68) v2(67.9,41.73) v2(67.89,35.03) v2(68.23,76.51) v2(68.14,44.93) v2(68.18,35.9) v2(68.25,45.9) v2(68.33,36.87) v2(68.28,34.12) v2(68.63,75.84) v2(68.6,1.02) v2(68.72,77.33) v2(68.81,74.37) v2(68.92,67.59) v2(68.84,35.03) v2(69.13,35.9) v2(69.18,76.51) v2(69.16,68.81) v2(69.23,34.12) v2(69.28,36.87) v2(69.58,75.84) v2(69.56,1.02) v2(69.67,77.33) v2(69.79,35.03) v2(70.13,76.51) v2(70.13,69.02) v2(70.08,35.9) v2(70.24,36.87) v2(70.51,1.02) v2(70.93,68.76) v2(71.04,24.1) v2(71.01,10.87) v2(71.01,9.92) v2(71.01,8.97) v2(71.01,8.01) v2(71.1,24.77) v2(71.14,23.44) v2(71.46,1.02) v2(73.7,1.07) v2(74.32,10.77) v2(74.32,9.82) v2(74.32,8.86) v2(74.32,7.91) v2(74.72,48.86) v2(74.66,1.07) v2(74.88,17.03) v2(75.28,47.94) v2(75.46,18.14) v2(75.61,1.07) v2(75.68,48.86) v2(75.83,17.03) v2(76.14,17.75) v2(76.24,47.94) v2(76.25,76.77) v2(76.63,48.86) v2(76.56,1.07) v2(76.78,17.03) v2(77.19,47.94) v2(77.43,10.67) v2(77.43,9.71) v2(77.43,8.76) v2(77.43,7.81) v2(77.44,18.46) v2(77.58,48.86) v2(77.61,17.75) v2(77.72,77.02) v2(77.73,17.03) v2(78.14,47.94) v2(78.34,14.99) v2(78.75,78.66) v2(78.82,60.08) v2(78.8,16.98) v2(79.11,1.27) v2(79.3,14.99) v2(79.67,61.05) v2(79.68,10.77) v2(79.68,9.82) v2(79.68,8.86) v2(79.68,7.91) v2(80.13,75.95) v2(80.06,1.27) v2(80.25,14.99) v2(80.59,61.15) v2(81.01,1.27) v2(81.08,75.95) v2(81.2,14.99) v2(81.25,32.37) v2(81.3,31.47) v2(81.3,30.4) v2(81.64,60.95) v2(81.71,24.68) v2(82.03,75.95) v2(81.97,1.27) v2(82.2,32.37) v2(82.25,31.47) v2(82.25,30.4) v2(82.49,79.49) v2(82.68,78.71) v2(82.66,24.68) v2(82.88,51.68) v2(82.98,75.95) v2(82.98,50.45) v2(83.16,32.37) v2(83.21,31.47) v2(83.21,30.4) v2(83.34,78.15) v2(83.49,57.64) v2(83.6,56.06) v2(83.62,24.68) v2(83.7,54.69) v2(83.83,51.68) v2(83.75,49.06) v2(83.94,50.45) v2(84.11,32.37) v2(84.06,22.8) v2(84.16,31.47) v2(84.16,30.4) v2(84.31,1.27) v2(84.45,57.64) v2(84.55,56.06) v2(84.57,24.68) v2(84.65,54.69) v2(84.7,49.06) v2(84.79,51.68) v2(84.89,50.45) v2(85.01,22.8) v2(85.28,59.07) v2(85.26,1.27) v2(85.4,57.64) v2(85.5,56.06) v2(85.6,54.69) v2(85.62,15.2) v2(85.66,49.06) v2(85.74,60.19) v2(85.74,51.68) v2(85.74,11.42) v2(85.84,50.45) v2(85.88,8.56) v2(85.88,7.6) v2(85.88,6.65) v2(85.88,5.7) v2(85.96,22.8) v2(86.03,16.42) v2(86.23,59.07) v2(86.2,18.1) v2(86.22,1.27) v2(86.35,57.64) v2(86.45,56.06) v2(86.55,54.69) v2(86.61,49.06) v2(86.57,15.2) v2(86.7,60.19) v2(86.66,53.21) v2(86.69,11.42) v2(86.93,79.55) v2(86.93,78.41) v2(86.93,77.44) v2(86.91,22.8) v2(86.98,16.42) v2(87.18,59.07) v2(87.17,1.27) v2(87.33,8.27) v2(87.33,7.32) v2(87.33,6.37) v2(87.33,5.41) v2(87.47,19.84) v2(87.53,15.2) v2(87.61,53.21) v2(87.65,60.19) v2(87.73,51.22) v2(87.64,11.42) v2(87.77,49.59) v2(87.78,48.19) v2(87.93,16.42) v2(88.13,88.24) v2(88.13,59.07) v2(88.34,92.94) v2(88.6,60.19) v2(88.56,53.21) v2(88.6,11.42) v2(88.6,8.17) v2(88.6,7.22) v2(88.6,6.26) v2(88.6,5.31) v2(88.68,51.22) v2(88.72,49.59) v2(88.73,48.19) v2(88.8,81.56) v2(88.85,79.06) v2(88.95,89.83) v2(89.05,88.7) v2(89.29,92.94) v2(89.51,53.21) v2(89.63,51.22) v2(89.68,49.59) v2(89.68,48.19) v2(89.9,89.83) v2(90,88.7) v2(90.24,92.94) v2(90.33,87.68) v2(90.58,51.22) v2(90.63,49.59) v2(90.64,48.19) v2(90.79,90.85) v2(90.85,89.83) v2(90.96,88.7) v2(91.74,90.85) v2(91.81,89.83) v2(91.91,88.7) v2(92.05,13.55) v2(92.05,12.6) v2(92.05,11.65) v2(92.05,10.7) v2(92.51,60.59) v2(92.54,87.73) v2(93.09,13.68) v2(93.09,12.72) v2(93.09,11.77) v2(93.09,10.82) v2(93.49,88.96) v2(93.69,86.71) v2(93.85,87.79) v2(94.1,60.95) v2(94.1,60) v2(94.1,59.05) v2(94.2,77.02) v2(94.25,84.73) v2(94.31,75.6) v2(94.26,13.88) v2(94.26,12.93) v2(94.26,11.98) v2(94.26,11.02) v2(94.41,78.3) v2(94.44,88.96) v2(94.65,86.71) v2(94.8,87.79) v2(94.76,69.63) v2(94.98,22.5) v2(94.98,21.55) v2(94.98,20.59) v2(94.98,19.64) v2(95.09,68.07) v2(95.21,84.73) v2(95.16,77.02) v2(95.26,75.6) v2(95.39,88.96) v2(95.36,78.3) v2(95.6,86.71) v2(95.72,69.63) v2(95.75,87.79) v2(95.84,14.03) v2(95.84,13.08) v2(95.84,12.13) v2(95.84,11.18) v2(96.11,77.02) v2(96.04,68.07) v2(96.16,84.73) v2(96.21,75.6) v2(96.31,78.3) v2(96.35,88.96) v2(96.55,86.71) v2(96.7,87.79) v2(96.67,69.63) v2(96.65,59.7) v2(96.65,58.74) v2(96.65,57.79) v2(96.65,56.84) v2(96.99,68.07) v2(97.03,22.61) v2(97.03,21.66) v2(97.03,20.71) v2(97.03,19.75) v2(97.11,84.73) v2(97.06,77.02) v2(97.16,75.6) v2(97.26,78.3) v2(97.43,55.9) v2(97.43,54.95) v2(97.43,54) v2(97.43,53.05) v2(97.43,51.93) v2(97.43,50.97) v2(97.43,50.02) v2(97.43,49.07) v2(97.62,69.63) v2(97.63,13.34) v2(97.63,12.38) v2(97.63,11.43) v2(97.67,60.29) v2(97.67,59.34) v2(97.67,58.38) v2(97.67,57.43) v2(97.94,68.07) v2(98.5,88.19) v2(98.5,87.24) v2(98.5,86.28) v2(98.5,85.33) v2(98.5,53.61) v2(98.5,52.66) v2(98.5,51.7) v2(98.5,50.75) v2(98.55,57.84) v2(98.55,56.89) v2(98.55,55.94) v2(98.55,54.99) v2(98.59,19.03) v2(98.59,18.08) v2(98.59,17.12) v2(98.59,16.17) v2(98.85,23.21) v2(98.85,22.26) v2(98.85,21.31) v2(98.85,20.36) v2(99.01,48.92) v2(99.01,47.96) v2(99.01,47.01) v2(99.01,46.06) v2(99.01,44.58) v2(99.01,43.63) v2(99.01,42.68) v2(99.01,41.73) v2(98.96,40.25) v2(98.96,39.29) v2(98.96,38.34) v2(98.96,37.39) v2(98.97,31.57) v2(98.97,30.62) v2(98.97,29.66) v2(98.97,28.71) v2(98.96,27.55) v2(98.96,26.6) v2(98.96,25.64) v2(98.96,24.69) v2(99.11,66.36) v2(99.11,65.41) v2(99.11,64.46) v2(99.11,63.5) v2(99.11,61.97) v2(99.11,61.02) v2(99.11,60.07) v2(99.11,59.12) v2(99.06,35.91) v2(99.06,34.96) v2(99.06,34.01) v2(99.06,33.06) v2(99.21,83.8) v2(99.21,82.85) v2(99.21,81.9) v2(99.21,80.95) v2(99.16,79.36) v2(99.16,78.41) v2(99.16,77.46) v2(99.16,76.51) v2(99.21,70.49) v2(99.21,69.54) v2(99.21,68.59) v2(99.21,67.63) v2(99.16,13.37) v2(99.26,75.03) v2(99.26,74.08) v2(99.26,73.13) v2(99.26,72.17)
VIN_24V: length 12.5
  Top Layer w1.2: 28.72,27.6 C2.1 28,20.2 D1.2
(no net):
  vias: v1(-8.26,31.64) v1(-8.23,33.57) v1(-8.25,32.94) v1(-8.23,32.32) v1(-8.25,30.89) v1(-7.6,33.57) v1(-7.61,32.94) v1(-7.6,32.32) v1(-7.63,31.64) v1(-7.62,30.89) v1(-6.97,32.94) v1(-6.99,31.64) v1(-6.98,30.89) v1(-6.96,33.57) v1(-6.96,32.32) v1(-6.32,33.57) v1(-6.34,32.94) v1(-6.32,32.32) v1(-6.35,31.64) v1(-6.34,30.89) v1(24.63,29.35) v1(24.66,31.27) v1(24.65,30.64) v1(24.66,30.03) v1(24.64,28.59) v1(25.3,31.27) v1(25.28,30.64) v1(25.3,30.03) v1(25.27,29.35) v1(25.28,28.59) v1(25.94,31.27) v1(25.92,30.64) v1(25.94,30.03) v1(25.91,29.35) v1(25.91,28.59) v1(26.57,31.27) v1(26.56,30.64) v1(26.57,30.03) v1(26.54,29.35) v1(26.55,28.59)
ESP_BOOT: length 25.1
  Top Layer w0.4: U3.25 81.35,45.5 80.64,44.78 v2(79.72,44.78) ; v2(66.41,29.54) 66.03,29.16 Q4.3
  Bottom Layer w0.4: v2(66.41,29.54) 76.15,39.28 76.15,41.21 v2(79.72,44.78)
ESP_RST: length 69.9
  Top Layer w0.3: P21.5 97.98,30.34 97.98,25.91 95.74,23.67 78.04,23.67 76.32,25.39 R18.1 70.78,27.19 Q5.3
  Top Layer w0.4: U3.3 95.32,49.08 v2(96.14,48.25)
  Bottom Layer w0.4: P21.5 98.03,34.17 98.03,46.37 v2(96.14,48.25)
HOLD: length 47
  Top Layer w0.3: U3.7 90.24,61.19 93.34,58.1 v2(93.34,48.1) ; 89.87,19.12 89.87,20.25 90.48,20.87 v2(91.25,20.87)
  Bottom Layer w0.3: v2(93.34,48.1) 93.34,37.8 92.06,36.52 92.06,21.68 v2(91.25,20.87)
M_EN_O: length 127.7
  Top Layer w0.4: v2(57.06,59.25) 57.3,59.01 U4.16 ; P18.4 49.9,67.12 47.98,69.04 47.98,87.06 H5.8 ; v2(32.32,67.12) 31.37,67.12 ; 31.37,67.12 v2(30.33,67.12) ; 31.37,67.12 31.4,67.16 31.4,87.25 H3.8
  Bottom Layer w0.4: H1.8 14.37,87.21 14.37,68.74 15.98,67.12 P16.4 19.13,65.68 28.89,65.68 v2(30.33,67.12) ; v2(32.32,67.12) P17.4 36.05,68.33 50.8,68.33 P18.4 52.01,66.85 53.79,65.06 53.79,62.51 v2(57.06,59.25)
MOTOR_EN: length 12.5
  Top Layer w0.4: U3.14 78.58,62.92 74.66,59.01 U4.1
MX_DIR: length 17
  Top Layer w0.4: U4.3 74.19,61.55 78.24,65.59 82.47,65.59 83.89,64.18 U3.12
MX_STEP: length 15.5
  Top Layer w0.4: U4.2 74.15,60.28 78.6,64.73 82.12,64.73 82.62,64.22 U3.13
MY_DIR: length 19.8
  Top Layer w0.4: U3.10 86.43,64.39 83.75,67.07 77.12,67.07 74.13,64.09 U4.5
MY_STEP: length 18.4
  Top Layer w0.4: U3.11 85.16,64.34 83.19,66.31 77.68,66.31 74.19,62.82 U4.4
MZ_DIR: length 22.8
  Top Layer w0.4: U3.8 88.97,64.81 85.13,68.65 76.05,68.65 74.02,66.63 U4.7
MZ_STEP: length 21.3
  Top Layer w0.4: U4.6 74.03,65.36 76.51,67.84 84.51,67.84 87.73,64.62 87.73,62.95 U3.9
PRE: length 28.7
  Top Layer w0.3: R20.1 89.31,70.13 94.51,64.93 v2(94.66,64.93) ; v2(94.87,48) 95.32,47.55 U3.36
  Bottom Layer w0.3: v2(94.66,64.93) 94.87,64.73 v2(94.87,48)
PROBE: length 38
  Top Layer w0.4: U3.23 78.25,49.98 76.46,51.77 76.46,59.27 v2(77.48,60.29) ; v2(90.84,77.83) R12.1
  Bottom Layer w0.4: v2(90.84,77.83) 90.84,73.65 v2(77.48,60.29)
PWM: length 34.3
  Top Layer w0.4: 62.06,52.03 62.01,52.08 62.01,52.03 62.06,52.03 ; 62.06,52.03 64.57,52.03 ; 64.57,52.03 64.57,49.63 62.55,47.61 R58.1 57.47,47.13 U6.2 ; 64.57,52.03 v2(64.57,52.08) ; v2(77.58,56.36) 77.58,57.74 78.71,58.87 U3.16
  Bottom Layer w0.4: v2(77.58,56.36) 77.53,56.36 73.24,52.08 v2(64.57,52.08)
PWM_5V: length 56.9
  Top Layer w0.4: 4.5,19.23 10.87,19.23 v2(17.55,25.91) ; R59.2 48.07,46.5 48,46.43 42.3,46.43
  Bottom Layer w0.4: v2(17.55,25.91) 27.39,25.91 39.94,38.46 39.94,44.07
QB: length 24.8
  Top Layer w0.4: U3.26 82.62,44.62 81.81,43.82 77.63,43.82 v2(75.54,45.91) ; 62.01,50.04 62.11,49.94 v2(63.45,49.94)
  Bottom Layer w0.4: v2(63.45,49.94) 71.51,49.94 v2(75.54,45.91)
RXD: length 48.1
  Top Layer w0.4: R67.1 88.05,41.57 89.83,41.57 92.78,44.52 U3.34 ; v2(69.47,31.28) 58.98,31.28 56.87,29.18 56.87,26.26
  Bottom Layer w0.4: v2(69.47,31.28) 79.55,41.37 v2(87.83,41.37)
RXD2: length 12.1
  Top Layer w0.4: U3.27 83.89,44.52 81.5,42.13 76.46,42.13 P15.2
SD_CD: length 44.7
  Top Layer w0.4: U8.9 65.16,17.12 65.83,17.79 R68.1 ; U3.33 91.51,44.23 89.46,42.18 87.06,42.18 v2(75.31,30.43)
  Bottom Layer w0.4: v2(65.75,17.65) 65.75,20.87 v2(75.31,30.43)
SD_CS: length 39.2
  Top Layer w0.4: U8.2 72.86,16.86 v2(73.14,17.14) 73.14,18.48 R63.1 ; v2(77.48,36.68) 78.48,36.68 86.43,44.62 U3.29
  Bottom Layer w0.4: v2(73.14,17.14) 77.48,21.48 v2(77.48,36.68)
SD_MISO: length 46.6
  Top Layer w0.4: v2(75.08,31.52) 86.4,42.85 87.83,42.85 88.97,43.99 U3.31 ; R66.1 67.82,17.79 67.36,17.33 U8.7
  Bottom Layer w0.4: v2(67.38,16.48) 65.75,16.48 64.78,17.45 64.78,21.22 v2(75.08,31.52)
SD_MOSI: length 50.2
  Top Layer w0.4: U3.37 96.59,43.09 91.04,37.54 v2(91.04,36.83) ; R64.1 71.34,17.69 71.76,17.27 U8.3
  Bottom Layer w0.4: v2(71.82,16.22) 82.27,16.22 91.04,25 v2(91.04,36.83)
SD_SCLK: length 39.4
  Top Layer w0.4: v2(76.46,34.13) 76.86,34.13 86.35,43.61 86.92,43.61 87.7,44.4 U3.30 ; v2(69.62,16.28) 69.56,16.22 U8.5
  Bottom Layer w0.4: v2(76.46,34.13) 76.41,34.07 76.41,23.06 v2(69.62,16.28)
SPN_PWM: length 46.4
  Top Layer w0.6: v2(18.57,31.07) 17.45,29.94 P20.2 ; 36.77,43.33 39.42,40.68 43.55,40.68
  Bottom Layer w0.6: v2(37.9,42.08) 29.38,33.56 21.07,33.56 v2(18.57,31.07)
START: length 28.2
  Top Layer w0.4: v2(72.33,68.81) 72.33,70.73 R19.1 ; v2(72.33,53.2) 72.33,46.1 73.35,45.07 R35.2
  Bottom Layer w0.4: v2(72.33,68.81) v2(72.33,53.2)
TXD: length 47.4
  Top Layer w0.4: U3.35 94.05,44.81 89.47,40.23 R65.1 ; R61.2 58.76,29.18 60.09,30.5 70.49,30.5 v2(70.8,30.81)
  Bottom Layer w0.4: v2(70.8,30.81) 70.8,30.86 80.08,40.14 89.41,40.14 v2(90.12,40.86)
TXD2: length 19.2
  Top Layer w0.4: U3.28 85.16,44.31 81.4,40.55 P15.3 77.42,40.4 76.24,39.23 74.42,39.23 73.55,40.09 73.55,43.32 R35.1
USB_DM: length 8.2
  Top Layer w0.4: U9.3 44.91,16.14 44.2,15.43 44.2,12.71
USB_DP: length 13
  Top Layer w0.4: 44.2,10.71 42.8,12.12 42.8,15.51 45.33,18.04 U9.1
VUSB: length 16.7
  Top Layer w0.4: P22.1 48.87,12.71 50.8,14.64 50.8,16.38 51.52,17.09 U9.5
  Top Layer w0.6: v2(40.81,14.69) D10.1
  Bottom Layer w0.6: P22.1 44.72,14.69 v2(40.81,14.69)
X_1A: length 25
  Top Layer w0.6: 26.95,77.69 28.33,77.69 H2.4
  Bottom Layer w1: P10.3 19.19,89.16 H2.4
X_1B: length 28.2
  Top Layer w0.6: 26.95,75.89 29.07,75.89 H2.3
  Bottom Layer w1: P10.4 16.65,94.51 17.91,93.26 17.91,87.91 H2.3
X_2A: length 21.7
  Top Layer w0.6: H2.5 27.59,79.49 26.95,79.49
  Bottom Layer w1: H2.5 21.73,89.16 P10.2
X_2B: length 18.4
  Top Layer w0.6: H2.6 26.95,81.39 26.95,81.29
  Bottom Layer w1: H2.6 24.27,89.16 P10.1
X_DIR_O: length 53.8
  Top Layer w0.4: P16.2 24.04,68.4 27.44,68.4 34.3,61.55 U4.14
  Bottom Layer w0.4: H1.1 17.99,71.24 22.1,67.12 P16.2
X_DIV1: length 17.8
  Top Layer w0.4: R45.1 24.58,69.62 22.04,69.62 H7.2 17.5,74.16 17.5,80.07 H1.5
X_DIV2: length 17.5
  Top Layer w0.4: H1.6 18.42,81.69 18.42,75.78 H7.4 21.62,72.58 24.95,72.58 R46.1
X_DIV3: length 17.8
  Top Layer w0.4: H1.7 20.36,82.29 H7.6 21.66,75.08 24.25,75.08 R50.1
X_LIMT: length 27.2
  Top Layer w0.3: R2.2 79.06,81.78 79.06,79.82 81.61,77.27 84.41,77.27 86.4,75.28 86.4,69.57 91.51,64.46 U3.6
X_LIMT_I: length 18.5
  Top Layer w0.4: C1.2 76.36,81.77 76.35,81.78 R2.1 R1.1 76.35,84.92 74.52,86.75 74.52,93.83 71.2,97.15 P1.1
X_STEP_O: length 55.9
  Top Layer w0.4: H1.2 18.27,71.69 18.27,70.39 20.22,68.43 P16.3 22.01,65.34 28.87,65.34 33.94,60.28 U4.15
Y_1A: length 44.8
  Top Layer w0.6: H4.4 44.81,77.7 R22.1
  Top Layer w1: P13.2 48.47,97.61 47.49,98.59 34.07,98.59 32.56,97.08 P9.3
  Bottom Layer w1: P9.3 32.56,94.8 41.01,86.35 41.01,83.82 H4.4
Y_1B: length 54.1
  Top Layer w0.6: H4.3 45.55,75.89 R21.1
  Bottom Layer w1: H4.3 44.87,76.32 39.58,81.61 39.58,85.53 30.02,95.1 P9.4 30.02,97.49 31.35,98.82 49.55,98.82 51.01,97.37 P13.1
Y_2A: length 40.2
  Top Layer w0.6: H4.5 44.07,79.5 R24.1
  Bottom Layer w1: P9.2 35.1,94.44 42.39,87.15 42.39,84.46 45.45,81.4 H4.5 46.51,81.4 47.9,82.78 47.9,92.22 45.93,94.18 P13.3
Y_2B: length 26
  Top Layer w0.6: R26.1 43.5,81.46 H4.6
  Bottom Layer w1: P13.4 P9.1 37.64,94.01 44.12,87.52 44.12,84.87 45.06,83.94 H4.6
Y_DIR_O: length 39
  Top Layer w0.4: U4.12 42.96,64.09 P17.2 ; v2(37.34,65.19) 34.59,65.19 33.17,66.6 H3.1
  Bottom Layer w0.4: v2(37.34,65.19) 37.99,65.19 P17.2
Y_DIV1: length 17.7
  Top Layer w0.4: 41.89,70.48 41.09,69.67 38.51,69.67 H8.2 34.84,73.34 34.84,79.73 H3.5
Y_DIV2: length 17.3
  Top Layer w0.4: H3.6 35.55,81.56 35.55,75.17 H8.4 38.09,72.63 40.65,72.63 40.99,72.28 41.89,72.28
Y_DIV3: length 17.6
  Top Layer w0.4: 41.89,74.08 40.9,75.08 38.19,75.08 H8.6 36.88,82.77 H3.7
Y_LIMT: length 24.4
  Top Layer w0.3: R5.2 83.44,81.63 83.44,79.41 87.01,75.84 87.01,70.03 92.78,64.26 U3.5
Y_LIMT_I: length 17.6
  Top Layer w0.4: P2.1 77.8,97.15 80.64,94.31 C4.2
Y_STEP_O: length 37.7
  Top Layer w0.4: U4.13 41.69,62.82 P17.3 35.2,69.31 35.2,71.76 H3.2
Z_1A: length 21.8
  Top Layer w0.6: H6.4 62.02,77.99 R29.1
  Bottom Layer w1: H6.4 59.29,82.46 P12.3
Z_1B: length 25.1
  Top Layer w0.6: H6.3 60.75,76.32 R27.1
  Bottom Layer w1: P12.4 56.75,82.46 H6.3
Z_2A: length 19.3
  Top Layer w0.6: H6.5 61.31,79.82 R31.1
  Bottom Layer w1: H6.5 60.9,83.39 60.9,91.5 61.83,92.43 P12.2
Z_2B: length 16.6
  Top Layer w0.6: H6.6 60.61,81.65 R32.1
  Bottom Layer w1: H6.6 64.62,85.67 64.62,96.26 P12.1
Z_DIR_O: length 17.7
  Top Layer w0.4: P18.2 58.57,65.64 61.51,65.64 62.5,66.63 U4.10
  Bottom Layer w0.4: H5.1 52.06,69.11 55.1,69.11 P18.2
Z_DIV1: length 18.5
  Top Layer w0.4: H5.5 50.81,81.4 51.62,80.59 51.62,73.6 H9.2 55.8,69.42 57.67,69.42 R52.1
Z_DIV2: length 17.3
  Top Layer w0.4: H5.6 52.38,81.49 52.38,75.37 H9.4 55.13,72.63 58.71,72.63 R54.1
Z_DIV3: length 17.7
  Top Layer w0.4: H5.7 53.92,82.5 H9.6 55.22,75.08 57.3,75.08 58.08,74.3 R55.1
Z_LIMT: length 23.1
  Top Layer w0.3: R9.2 86.41,82.87 87.88,81.4 87.88,70.54 94.05,64.37 U3.4
Z_LIMT_I: length 18.3
  Top Layer w0.4: P3.1 84.17,97.15 87.12,94.2 87.12,90.07 84.83,87.78 C11.2
Z_STEP_O: length 20.2
  Top Layer w0.4: H5.2 52.03,71.69 52.03,70.59 54.55,68.07 54.55,67.12 56.94,64.73 61.92,64.73 62.55,65.36 U4.11
$9N72390: length 10.5
  Top Layer w0.8: U1.2 31,29.26 L1.2 33.97,23.17 D2.2
$9N72392: length 2.8
  Top Layer w0.6: U1.4 28.52,32.07 R7.1
$9N72730: length 2.1
  Top Layer w0.4: D3.1 17.8,12.73 R3.1
$9N85928: length 7.8
  Top Layer w0.3: 55.41,15.43 54.61,15.43 53.97,16.07 53.97,20.57 53.39,21.14 C23.1
$9N85949: length 6
  Top Layer w0.3: 55.41,14.16 54.73,14.16 53.3,15.59 53.3,17.45 52.71,18.04 U9.6
$9N85958: length 5
  Top Layer w0.3: 55.41,12.89 54.73,12.89 52.15,15.47 U9.4
$9N85962: length 12.6
  Top Layer w0.3: 55.41,11.62 57.4,11.62 58.35,10.67 58.35,8.43 60.3,6.48 Y1.2
  Top Layer w0.4: C24.1 61.05,3.41 Y1.2
$9N85965: length 7.3
  Top Layer w0.3: 55.41,10.35 55.41,6.52 Y1.1
  Top Layer w0.4: C25.1 55.45,3.36 Y1.1
$9N85990: length 4.1
  Top Layer w0.6: D10.2 44.88,20.62 H10.2
$9N86544: length 8.3
  Top Layer w0.3: R60.1 56.87,22.5 57.54,21.83 57.54,18.83 56.68,17.97 U7.2
$9N86546: length 9.7
  Top Layer w0.3: U7.3 56.64,16.7 58.35,18.42 58.35,23.4 58.76,23.8 R61.1
$9N86982: length 16.7
  Top Layer w0.3: Q4.2 66.44,27.16 66.92,26.68 66.92,24.13 66.32,23.53 R69.1 65.59,22.8 64.32,21.53 64.32,16.73 63.02,15.43 U7.13
$9N86987: length 15.1
  Top Layer w0.3: Q5.2 67.63,25.66 v2(67.63,25.41) ; U7.14 62.65,16.7 63.6,17.65 v2(63.6,22.29) R62.1
  Bottom Layer w0.3: v2(63.6,22.29) 64.52,22.29 v2(67.63,25.41)
$9N87254: length 13.9
  Top Layer w0.4: v2(89.49,36.1) 88.85,36.74 R65.2 ; P21.6 93.49,32.17 P23.3
  Bottom Layer w0.4: P23.3 87.67,32.17 89.49,33.99 v2(89.49,36.1)
$9N87257: length 10.4
  Top Layer w0.4: P21.8 93.49,34.71 P23.4 86.76,35.37 R67.2
$9N88603: length 8.4
  Top Layer w0.4: 60.41,50.04 60.41,52.03 58.81,53.62 58.81,54.64 58.44,54.27 55.88,54.27
$9N88605: length 4.8
  Top Layer w0.4: 43.2,57.04 43.2,55.08 43.13,55.01 45.8,55.01 45.87,55.09
$9N88961: length 2.9
  Top Layer w0.4: U6.4 50.19,48.08 50.18,48.1
$9N89002: length 12.9
  Top Layer w0.4: 53.08,55.22 47.81,55.22 47.52,54.93 ; 47.47,55.09 47.47,48.63 48,48.1 48,48.03
$9N89334: length 2
  Top Layer w0.3: 63.6,25.13 63.62,25.15 Q4.1
$9N89338: length 4.8
  Top Layer w0.3: v2(66.26,26.07) 65.59,25.41 65.59,25.13 ; Q5.1 v2(67.02,28.14)
  Bottom Layer w0.3: v2(67.02,28.14) 67.02,26.83 v2(66.26,26.07)
$9N90234: length 2.5
  Bottom Layer w0.8: H1.4 H1.3
$9N91167: length 2.5
  Bottom Layer w0.8: H3.4 H3.3
$9N91379: length 2.5
  Bottom Layer w0.8: H5.4 H5.3
$9N98710: length 32.1
  Top Layer w0.4: P7.1 84.06,3.98 82.78,5.27 K1.3 ; K1.3 79.62,18.23 79.31,18.54 ; K1.3 82.78,20 80.08,22.7 73.67,22.7 R18.2
$9N100309: length 9
  Top Layer w0.4: P8.1 78.52,71.87 78.16,72.23 C15.2 77.32,72.17 R19.2 75.42,72.12 R16.2
$9N100484: length 10.9
  Top Layer w0.4: C12.2 89.09,83.45 R11.2 89.05,83.36 90.84,81.57 R12.2 90.91,80.9 P4.1
$9N100628: length 9.2
  Top Layer w0.4: R20.2 91.08,73.69 C16.2 91.15,71.79 R17.2 91.48,71.46 P6.1
$9N100772: length 9.6
  Top Layer w0.4: R13.2 89.87,15.19 89.87,17.52 91.67,17.52 C13.2 93.5,15.77 P5.1
$9N100840: length 2.3
  Top Layer w0.4: D7.1 17.81,17.11 R10.1
$9N100955: length 2.2
  Top Layer w0.4: D5.1 15.79,15.01 R6.1

## Copper pours and planes (outline as drawn; the poured copper is in the pictures)
GND on Top Layer: -1.95,101.84 102.3,101.84 102.3,-2.41 -1.95,-2.41
GND on Bottom Layer: -2.66,102.35 101.58,102.35 101.58,-1.9 -2.66,-1.9

Small or netless copper shapes (teardrops, artwork), in the pictures only: 421 on Top Layer, 132 on Bottom Layer

## Text on the board
Top Silkscreen Layer: GND | 24V_X | 24V_Y | 24V+ | X-MOTOR | Y1-MOTOR | Y2-MOTOR | Z-MOTOR | X_LIMIT | Y_LIMIT | Reset | Z_LIMIT | 5V | LIMIT | PWM1 | PWM2 | 24V_Z | RX | TX | Start | Pre | Hold | Probe | 48V_SPN+ | 48V_SPN-
